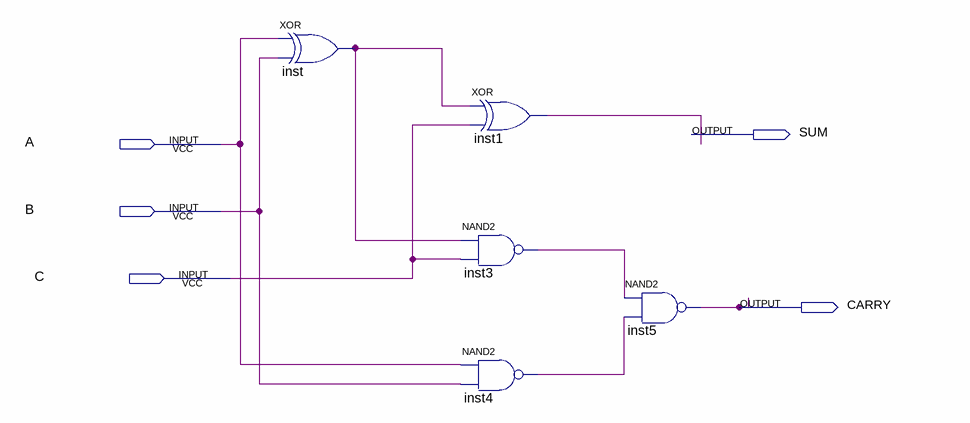
[diagram p0: schematic sheet]
// Quartus schematic LAB1.bdf as structural Verilog: 5 symbols, 5 pins
module LAB1 (
  input  A,
  input  B,
  input  C,
  output SUM,
  output CARRY
);

  wire inst1_out, inst3_out, inst4_out, inst_out;

  xor inst (inst_out, A, B);
  xor inst1 (inst1_out, inst_out, C);
  nand inst3 (inst3_out, inst_out, C);
  nand inst4 (inst4_out, A, B);
  nand inst5 (CARRY, inst3_out, inst4_out);
endmodule
